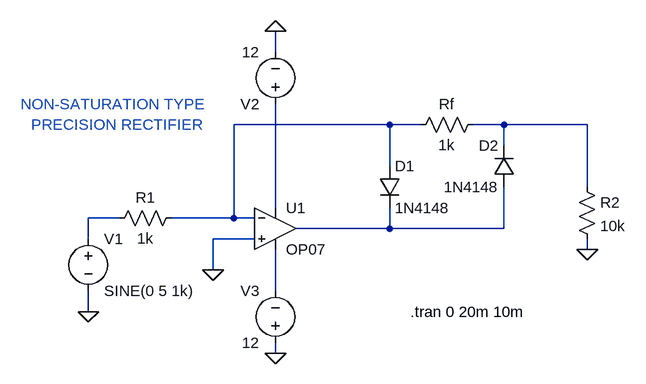
[diagram p0: schematic Non-Saturation Type.asc]
Non-Saturation Type.asc, the LTspice schematic file:
Version 4
SHEET 1 1296 680
WIRE 192 -112 192 -144
WIRE 368 0 128 0
WIRE 416 0 368 0
WIRE 544 0 496 0
WIRE 672 0 544 0
WIRE 544 32 544 0
WIRE 368 64 368 0
WIRE 672 96 672 0
WIRE 192 128 192 -32
WIRE -48 144 -96 144
WIRE 128 144 128 0
WIRE 128 144 32 144
WIRE 160 144 128 144
WIRE 368 160 368 128
WIRE 368 160 224 160
WIRE 544 160 544 96
WIRE 544 160 368 160
WIRE -96 176 -96 144
WIRE 160 176 96 176
WIRE 672 192 672 176
WIRE 96 224 96 176
WIRE 192 256 192 192
WIRE -96 288 -96 256
WIRE 192 352 192 336
FLAG 672 192 0
FLAG 96 224 0
FLAG 192 -144 0
FLAG 192 352 0
FLAG -96 288 0
SYMBOL diode 352 64 R0
SYMATTR InstName D1
SYMATTR Value 1N4148
SYMBOL diode 560 96 R180
WINDOW 0 24 64 Left 2
WINDOW 3 24 0 Left 2
SYMATTR InstName D2
SYMATTR Value 1N4148
SYMBOL res 400 16 R270
WINDOW 0 32 56 VTop 2
WINDOW 3 0 56 VBottom 2
SYMATTR InstName Rf
SYMATTR Value 1k
SYMBOL res 656 80 R0
SYMATTR InstName R2
SYMATTR Value 10k
SYMBOL res 48 128 R90
WINDOW 0 0 56 VBottom 2
WINDOW 3 32 56 VTop 2
SYMATTR InstName R1
SYMATTR Value 1k
SYMBOL voltage 192 -16 R180
WINDOW 123 0 0 Left 2
WINDOW 39 0 0 Left 2
SYMATTR InstName V2
SYMATTR Value 12
SYMBOL voltage 192 352 R180
WINDOW 0 24 96 Left 2
WINDOW 3 24 16 Left 2
SYMATTR InstName V3
SYMATTR Value 12
SYMBOL voltage -96 160 R0
WINDOW 123 24 124 Left 2
WINDOW 39 0 0 Left 2
SYMATTR InstName V1
SYMATTR Value SINE(0 5 1k)
SYMBOL Opamps\\OP07 192 96 R0
SYMATTR InstName U1
TEXT 400 288 Left 2 !.tran 0 20m 10m
TEXT -200 -32 Left 2 ;NON-SATURATION TYPE
TEXT -184 0 Left 2 ;PRECISION RECTIFIER

The netlist it stands for:
* Non-Saturation Type.asc
D1 N001 N005 1N4148
D2 N005 N002 1N4148
Rf N001 N002 1k
R2 N002 0 10k
R1 N001 N004 1k
V2 N003 0 12
V3 0 N006 12
V1 N004 0 SINE(0 5 1k)
XU1 0 N001 N003 N006 N005 LT1001  ; OP07, pins In+ In- V+ V- OUT
.model D D
.lib standard.dio
.tran 0 20m 10m
* NON-SATURATION TYPE
* PRECISION RECTIFIER
.lib LTC.lib
.backanno
.end